# Altium schematic sheet dcb_single_channel.SchDoc
size A4; SheetNumber: 2; SheetTotal: 7
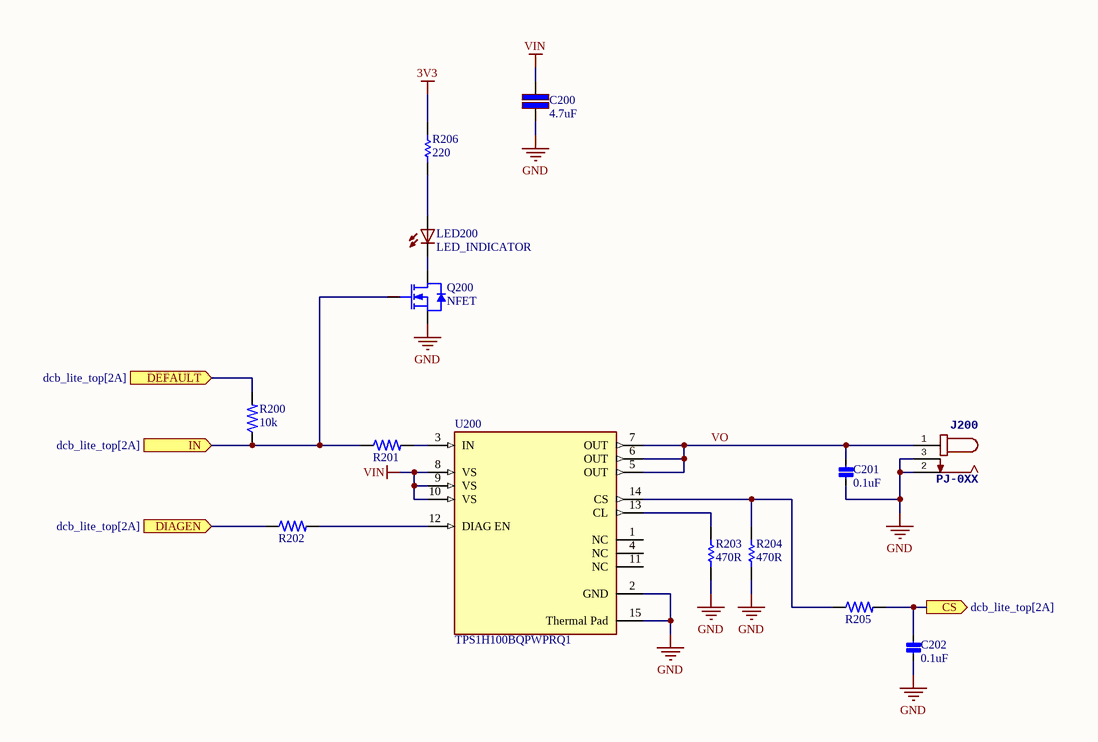
[diagram p0: dcb_single_channel.SchDoc]

## Parts
C200  value 4.7uF  [CAPC3225X20N]  (hidden comment: CAP 4.7uF 50V X7R 1210)
C201  value 0.1uF  [FP-CL10-IPC_B]  (hidden comment: CAP 0.1uF 50V X7R 0603)
C202  value 0.1uF  [FP-CL10-IPC_B]  (hidden comment: CAP 0.1uF 50V X7R 0603)
J200  PJ-0XX  [CUI-PJ-002A_V]
LED200  LED_INDICATOR  [LED5MM]
Q200  NFET  [SOT23-3]
R200  value 10k  [RESC1608-IPC-ML]  (hidden comment: 10K 0603 1%)
R201  4.7k 0603 1%  [RESC1608-IPC-ML]  (value not drawn)
R202  4.7k 0603 1%  [RESC1608-IPC-ML]  (value not drawn)
R203  value 470R  [RESC2013X60X35LL10T20]  (hidden comment: RC0805FR-07470RL)
R204  value 470R  [RESC2013X60X35LL10T20]  (hidden comment: RC0805FR-07470RL)
R205  4.7k 0603 1%  [RESC1608-IPC-ML]  (value not drawn)
R206  value 220  [RESC1608-IPC-ML]  (hidden comment: 220R 0603 5%)
U200  TPS1H100BQPWPRQ1  [FP-PWP0014C-IPC_C]

## Ports
CS (out, see dcb_lite_top[2A]), DEFAULT (in, see dcb_lite_top[2A]), DIAGEN (in, see dcb_lite_top[2A]), IN (in, see dcb_lite_top[2A])

## Nets
3V3: R206.2
GND: C200.1 C201.2 C202.2 J200.2 J200.3 Q200.2(S) R203.1 R204.1 U200.2(GND) U200.15(Thermal_Pad)
VIN: C200.2 U200.8(VS) U200.9(VS) U200.10(VS)
CS: C202.1 R205.2 ; port CS
DEFAULT: R200.2 ; port DEFAULT
DIAGEN: R202.1 ; port DIAGEN
IN: Q200.1(G) R200.1 R201.1 ; port IN
VO: C201.1 J200.1 U200.5(OUT) U200.6(OUT) U200.7(OUT)
NetLED200_A: LED200.A R206.1
NetLED200_C: LED200.C Q200.3(D)
NetR201_2: R201.2 U200.3(IN)
NetR202_2: R202.2 U200.12(DIAG_EN)
NetR203_2: R203.2 U200.13(CL)
NetR204_2: R204.2 R205.1 U200.14(CS)

Not connected (* = marked no-connect by the designer): U200 1(NC) 4(NC) 11(NC)

## Notes on the sheet
- Title
- Size:
- Date:
- A4
- Number:
- Time:
- Revision:
- Sheet
- of
- github.com/blueacro
- blueacro.com
- CERN OHL v2.0
- Made available under the
- File:
- © 2024 StackFoundry LLC. All Rights Reserved.

## Library data of the parts
C200 = CMP-001-00083-3: CAP CER 4.7UF 50V X7R 1210; Tolerance: 10%; Material: Ceramic; Voltage: 50V; Capacitance: 4.7uF; Width: 0.098inch; Height: 1.8mm; Depth: 2.5mm; Package Quantity: 1; Case/Package: 1210; Case Code (Imperial): 1210; Contact Plating: Tin; Thickness: 0.079inch; Radiation Hardening: No; Voltage Rating: 50V; Packaging: Tape and Reel; Lead Free: Lead Free; Dielectric: X7R; Min Operating Temperature: -55°C; Case Code (Metric): 3225; Max Operating Temperature: 125°C; Mount: Surface Mount; Length: 3.2mm
C201 C202 = CMP-001-00084-7: Cap Ceramic 0.1uF 50V X7R 20% SMD 0603 125C Paper T/R; Voltage: 50V
J200 = CMP-167-0003-2: 2.0 x 6.5 mm, 2.5 A, Horizontal, Through Hole, Dc Power Jack Connector; Design Item ID: PJ-0XX; Source: con-jack.SCHLIB
LED200 = CMP-130-0003-6: Source: led.SchLib; Design Item ID: LED_INDICATOR
Q200 = CMP-094-0000-1: Design Item ID: NFET; Source: fet.SchLib
R200 = CMP-009-00191-4: Res General Purpose Thick Film 0603 10K Ohm 1% 1/10W ±100ppm/°C Molded SMD Paper T/R
R201 R202 R205 = CMP-009-00205-1: RES SMD 4.7K OHM 1% 1/10W 0603
R203 R204 = CMP-009-00233-1: SMD Chip Resistor, 470 Ohm, ± 1%, 125 mW, 0805 [2012 Metric], Thick Film, General Purpose; Voltage Rating (AC): 150V; Temperature Coefficient: 100ppm/°C; Power Rating: 125mW; Min Operating Temperature: -55°C; Series: RC; Construction: Rectangular; Resistance Tolerance: 1%; Height: 0.5mm; Resistor Type: Thick Film; Pins: 2; Case Code (Imperial): 0805; Depth: 1.25mm; Reach SVHC Compliant: Unknown; Case Code (Metric): 2012; Tolerance: 1%; Max Operating Temperature: 155°C; Termination: SMD/SMT; Length: 2mm; Lead Pitch: 0.4mm; RoHS Compliant: Yes; Case/Package: 0805; Voltage Rating: 150V; Number of Terminations: 2; Features: Moisture Resistant; Packaging: Tape and Reel; Voltage Rating (DC): 150V; Width: 1.25mm; Lead Free: Lead Free; Package Quantity: 5000; Max Power Dissipation: 125mW
R206 = CMP-009-00183-3: YAGEO - RC0603JR-07220RL - SMD Chip Resistor, 0603 [1608 Metric], 220 ohm, RC Series, 75 V, Thick Film, 100 mW; Power Rating: 100mW; Working Voltage: 75V; Temperature Coefficient: 100ppm/°C; Voltage Rating (DC): 50V; Military Standard: Not; Resistance: 220R; Case Code (Metric): 1608; Max Operating Temperature: 155°C; Tolerance: 5%; Case/Package: 0603; REACH SVHC: No SVHC; Case Code (Imperial): 0603; Number of Terminations: 2; Termination: SMD/SMT; Min Operating Temperature: -55°C; Packaging: Tape and Reel; Resistor Type: Thick Film; Number of Pins: 2; Depth: 0.8mm; Voltage Rating: 50V; Width: 0.8mm; Lead Free: Lead Free; Length: 1.6mm
U200 = CMP-024-00009-1: Current Limit SW 1-IN 1-OUT 5V to 40V 4A Automotive 14-Pin HTSSOP EP T/R; Number of Channels: 1; Min Supply Voltage: 3.5V; Output Configuration: High Side; Interface: On/Off; Fault Protection: Over Temperature; Packaging: Cut Tape; Max Supply Voltage: 40V; Lead Free: Lead Free; Max Operating Temperature: 125°C; Number of Outputs: 1; Height: 1.2mm; Length: 5mm; Pins: 14; Thickness: 1mm; RoHS Compliant: Yes; Min Operating Temperature: -40°C; Case/Package: HTSSOP; Width: 4.4mm; Series: Automotive, AEC-Q100; Max Output current: 4A